# Altium project R1051-Caceres-PF.PrjPcb (part 2 of 3)

## Sheet Audio Memory.SchDoc: Audio Memory
size A4; Organization: Altium Limited; Address1: L3, 12a Rodborough Rd; Address2: Frenchs Forest; Address3: NSW; Address4: Australia 2086; Revision: 1; SheetNumber: 7; SheetTotal: 11; Alumno: Diego Caceres; Curso: R1051; Materia: Sistemas de Representación; Docentes: Ing. Perdomo, Ing. Fuoco, Ing. Giorno, Sr. Vergili
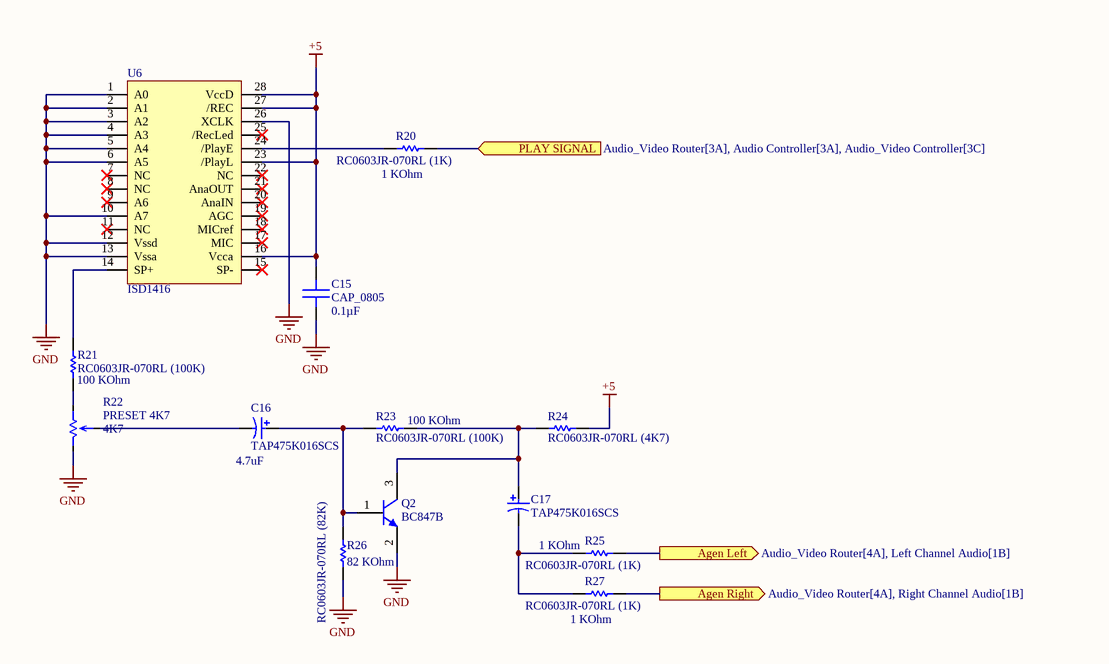
[diagram p6: Audio Memory.SchDoc]

### Parts
C15  CAP_0805  value 0.1µF  [0805_CAPACITOR_DCACERES]
C16  TAP475K016SCS  Capacitance: 4.7uF  [AVX-TAP475K016SCS]
C17  TAP475K016SCS  [AVX-TAP475K016SCS]
Q2  BC847B  [INF-SOT23_M]
R20  RC0603JR-070RL (1K)  Resistance: 1 KOhm  [RESC1608X55X25ML10T15]
R21  RC0603JR-070RL (100K)  Resistance: 100 KOhm  [RESC1608X55X25ML10T15]
R22  PRESET 4K7  value 4K7  [3386P_PRESET_4K7_DCaceres]
R23  RC0603JR-070RL (100K)  Resistance: 100 KOhm  [RESC1608X55X25ML10T15]
R24  RC0603JR-070RL (4K7)  [RESC1608X55X25ML10T15]
R25  RC0603JR-070RL (1K)  Resistance: 1 KOhm  [RESC1608X55X25ML10T15]
R26  RC0603JR-070RL (82K)  Resistance: 82 KOhm  [RESC1608X55X25ML10T15]
R27  RC0603JR-070RL (1K)  Resistance: 1 KOhm  [RESC1608X55X25ML10T15]
U6  ISD1416  [28-Lead_0.600-Inch_PDIP_ISD1416_DCACERES]

### Ports
Agen Left (out, see Audio_Video Router[4A], Left Channel Audio[1B]), Agen Right (out, see Audio_Video Router[4A], Right Channel Audio[1B]), PLAY SIGNAL (in, see Audio_Video Router[3A], Audio Controller[3A], Audio_Video Controller[3C])

### Nets
+5: C15.2 R24.2 U6.16(Vcca) U6.23(/PlayL) U6.27(/REC) U6.28(VccD)  [project net VDD]
GND: C15.1 Q2.2(E) R22.1 R26.2 U6.1(A0) U6.2(A1) U6.3(A2) U6.4(A3) U6.5(A4) U6.6(A5) U6.10(A7) U6.12(Vssd) U6.13(Vssa) U6.26(XCLK)
Agen Left: R25.1 ; port Agen Left
Agen Right: R27.1 ; port Agen Right
PLAY SIGNAL: R20.1 ; port PLAY SIGNAL
NetC16_1: C16.1 Q2.1(B) R23.1 R26.1
NetC16_2: C16.2 R22.3
NetC17_1: C17.1 Q2.3(C) R23.2 R24.1
NetC17_2: C17.2 R25.2 R27.2
NetR20_2: R20.2 U6.24(/PlayE)
NetR21_1: R21.1 U6.14(SP+)
NetR21_2: R21.2 R22.2

Not connected (* = marked no-connect by the designer): U6 7(NC)* 8(NC)* 9(A6)* 11(NC)* 15(SP-)* 17(MIC)* 18(MICref)* 19(AGC)* 20(AnaIN)* 21(AnaOUT)* 22(NC)* 25(/RecLed)*

### Notes on the sheet
- Title:
- Revision:
- Alumno:
- Materia:
- Docentes:
- Curso:
- File:
- Date:
- Sheet
- of

### Library data of the parts
C15 = CAPACITOR_0805_Caceres: Capacitor SMD, encapsulado 0805; SizePackage: 0805; ComponentLink1Description: Datasheet1; ComponentLink1URL: https://www.mouser.com/datasheet/2/40/AutoMLCCKAM-3216307.pdf; ComponentLink2Description: Datasheet2; ComponentLink2URL: https://www.mouser.com/datasheet/2/447/KEM_C1086_U2J-3316409.pdf; ComponentLink3Description: Datasheet3; ComponentLink3URL: https://product.tdk.com/system/files/dam/doc/product/capacitor/ceramic/mlcc/catalog/mlcc_commercial_soft_en.pdf
C16 = CMP-2000-07562-1: Dipped Radial Capacitor, 4.7 uF, +/- 10%, 16 V, -55 to 125 degC, RoHS, Bulk; Manufacturer: AVX; Life (Hours): 1000Hour; Dissipation Factor: 6%; Voltage: 16V; Polarity: Polar; ESR (Equivalent Series Resistance): 5Ohm; Lead Diameter: 0.5mm; Dielectric Material: Tantalum; Leakage Current: 600nA; Mounting Technology: ThroughHole; Tolerance: 10%; Number of Pins: 2; REACH SVHC: NoSVHC; RoHSCompliant: True; Min Operating Temperature: -55degC; Packaging: Bulk; Termination: Radial; Case\/Package: Dipped; Lead Free: LeadFree; Voltage Rating: 16V; Radiation Hardening: No; Package Quantity: 1000; Voltage Rating (DC): 16V; Height - Seated (Max): 0.295inch; Mount: PCB; Max Operating Temperature: 125degC; Datasheet URL: http://datasheets.avx.com/tap.pdf; Datasheet Version: 08/2015; Manufacturer URL: http://www.avx.com/; Package Reference: TAP475K016SCS; Lead Pitch: 2.5mm; Length: 7.5mm; Package Description: 2-Pin Through Hole Device, Dia 4.5 mm, Height 7.5 mm; Height: 7.5mm; Diameter: 4.5mm
C17 = CMP-2000-07562-1: Dipped Radial Capacitor, 4.7 uF, +/- 10%, 16 V, -55 to 125 degC, RoHS, Bulk; Manufacturer: AVX; Life (Hours): 1000Hour; Dissipation Factor: 6%; Voltage: 16V; Polarity: Polar; ESR (Equivalent Series Resistance): 5Ohm; Lead Diameter: 0.5mm; Dielectric Material: Tantalum; Capacitance: 4.7uF; Leakage Current: 600nA; Mounting Technology: ThroughHole; Tolerance: 10%; Number of Pins: 2; REACH SVHC: NoSVHC; RoHSCompliant: True; Min Operating Temperature: -55degC; Packaging: Bulk; Termination: Radial; Case\/Package: Dipped; Lead Free: LeadFree; Voltage Rating: 16V; Radiation Hardening: No; Package Quantity: 1000; Voltage Rating (DC): 16V; Height - Seated (Max): 0.295inch; Mount: PCB; Max Operating Temperature: 125degC; Datasheet URL: http://datasheets.avx.com/tap.pdf; Datasheet Version: 08/2015; Manufacturer URL: http://www.avx.com/; Package Reference: TAP475K016SCS; Lead Pitch: 2.5mm; Length: 7.5mm; Package Description: 2-Pin Through Hole Device, Dia 4.5 mm, Height 7.5 mm; Height: 7.5mm; Diameter: 4.5mm
Q2 = CMP-1177-00042-1: NPN Silicon AF Transistor, 45 V VCEO, 100 mA IC, SOT23, Reel, Green; Manufacturer: Infineon; VEBO (max): 6Â V; ICBO (max): 15Â nA; VCBO (max): 50Â V; IBM (max): 200Â mA; Green: TRUE; Ptot (max): 330Â mW; fT (typ): 250Â MHz; IC (max): 100Â mA; VCEO (max): 45Â V; PackageDescription: 3-Pin Small Outline Transistor Package, 1.3 x 2.9 mm Body, 0.95 mm Pitch; ComponentLink3URL: http://www.infineon.com/dgdl/SOT23-Package_Overview.pdf?folderId=db3a30431936bc4b0119532290053c66&fileId=db3a30431936bc4b0119533468123c85; PackageVersion: Apr-08; Packing: Reel; ComponentLink3Description: Package Specification; ComponentLink2URL: http://www.infineon.com/dgdl/bc847series_bc848series_bc849series_bc850series.pdf?folderId=db3a304314dca389011541d30fa21656&fileId=db3a304314dca389011541d4630a1657; ComponentLink1URL: http://www.infineon.com/; ComponentLink2Description: Datasheet; Polarity: NPN; Mounting Technology: Surface Mount; PackageReference: SOT23; ICM (max): 200Â mA; ComponentLink1Description: Manufacturer URL; PartNumber: BC847B
R20 R21 R23 R25-R27 = CMP-2100-03667-1: as R1 on sheet Sync Decoder; Width: 0.8mm; Max Operating Temperature: 155degC; Tolerance: 5%; Package Reference: 0603; Height: 0.45mm; Depth: 0.8mm; Package Description: 2-Pin Surface Mount Device, Body 1.6 x 0.8 mm; Termination: SMD/SMT; Package Quantity: 5000; Case/Package: 0603; Case Code (Imperial): 0603; Radiation Hardening: No; Number of Pins: 2; Length: 1.6mm; Lead Free: LeadFree; Voltage Rating (DC): 50V; Military Standard: Not; Datasheet URL: http://www.yageo.com/NewPortal/yageodocoutput?fileName=/pdf/R-Chip/PYu-RC_Group_51_RoHS_L_5.pdf; Manufacturer URL: http://www.yageo.com/; Packaging: TapeandReel; Case Code (Metric): 1608; Min Operating Temperature: -55degC; Composition: ThickFilm; RoHSCompliant: true; Contact Plating: Tin; Datasheet Version: Rev. 5, 10/2016; REACH SVHC: NoSVHC
R22 = Preset_4K7_Caceres: Preset 4K7, Thru HoleManufacturer Part Search 3386P-1-472LF; PartNumber: 3386P-1-472LF; ComponentLink1Description: Package Specification; ComponentLink1URL: https://ar.mouser.com/datasheet/2/54/3386-776606.pdf; ComponentLink2Description: URL Link; ComponentLink2URL: https://www.mouser.com/ProductDetail/Bourns/3386P-1-472LF?qs=g1MxsQ5vwlSvqan31esVSg%3D%3D
R24 = CMP-2100-03667-1: Chip Resistor, 0 Ohm, +/- 5%, 0.1 W, -55 to 155 degC, 0603 (1608 Metric), RoHS, Tape and Reel; Manufacturer: Yageo; Temperature Coefficient: 200ppm/degreesC; Voltage Rating: 50V; Power Rating: 100mW; Resistance: 0mOhm; Width: 0.8mm; Max Operating Temperature: 155degC; Tolerance: 5%; Package Reference: 0603; Height: 0.45mm; Depth: 0.8mm; Package Description: 2-Pin Surface Mount Device, Body 1.6 x 0.8 mm; Termination: SMD/SMT; Package Quantity: 5000; Case/Package: 0603; Case Code (Imperial): 0603; Radiation Hardening: No; Number of Pins: 2; Length: 1.6mm; Lead Free: LeadFree; Voltage Rating (DC): 50V; Military Standard: Not; Datasheet URL: http://www.yageo.com/NewPortal/yageodocoutput?fileName=/pdf/R-Chip/PYu-RC_Group_51_RoHS_L_5.pdf; Manufacturer URL: http://www.yageo.com/; Packaging: TapeandReel; Case Code (Metric): 1608; Min Operating Temperature: -55degC; Composition: ThickFilm; RoHSCompliant: true; Contact Plating: Tin; Datasheet Version: Rev. 5, 10/2016; REACH SVHC: NoSVHC
U6 = ISD1416_Caceres: ISD1416P, Thru Hole / IC MEM VOICE REC/PLAY 16S 28DIP / 28-Lead 0.600-Inch Plastic Dual Inline Package (PDIP); Manufacturer: Nuvoton; ComponentLink1Description: Datasheet1; ComponentLink1URL: https://pdf1.alldatasheet.com/datasheet-pdf/view/80293/ETC/ISD1416.html; PartNumber: ISD1416P; Package: PDIP-28; ComponentLink2Description: Datasheet2; ComponentLink2URL: https://datasheet.ciiva.com/1788/isd1400-rev1-3-1788428.pdf?src-supplier=Digi-Key

## Sheet RGB to PAL Encoder.SchDoc: RGB to PAL Encoder
size A4; Organization: Altium Limited; Address1: L3, 12a Rodborough Rd; Address2: Frenchs Forest; Address3: NSW; Address4: Australia 2086; Revision: 1; SheetNumber: 8; SheetTotal: 11; Alumno: Diego Caceres; Curso: R1051; Materia: Sistemas de Representación; Docentes: Ing. Perdomo, Ing. Fuoco, Ing. Giorno, Sr. Vergili
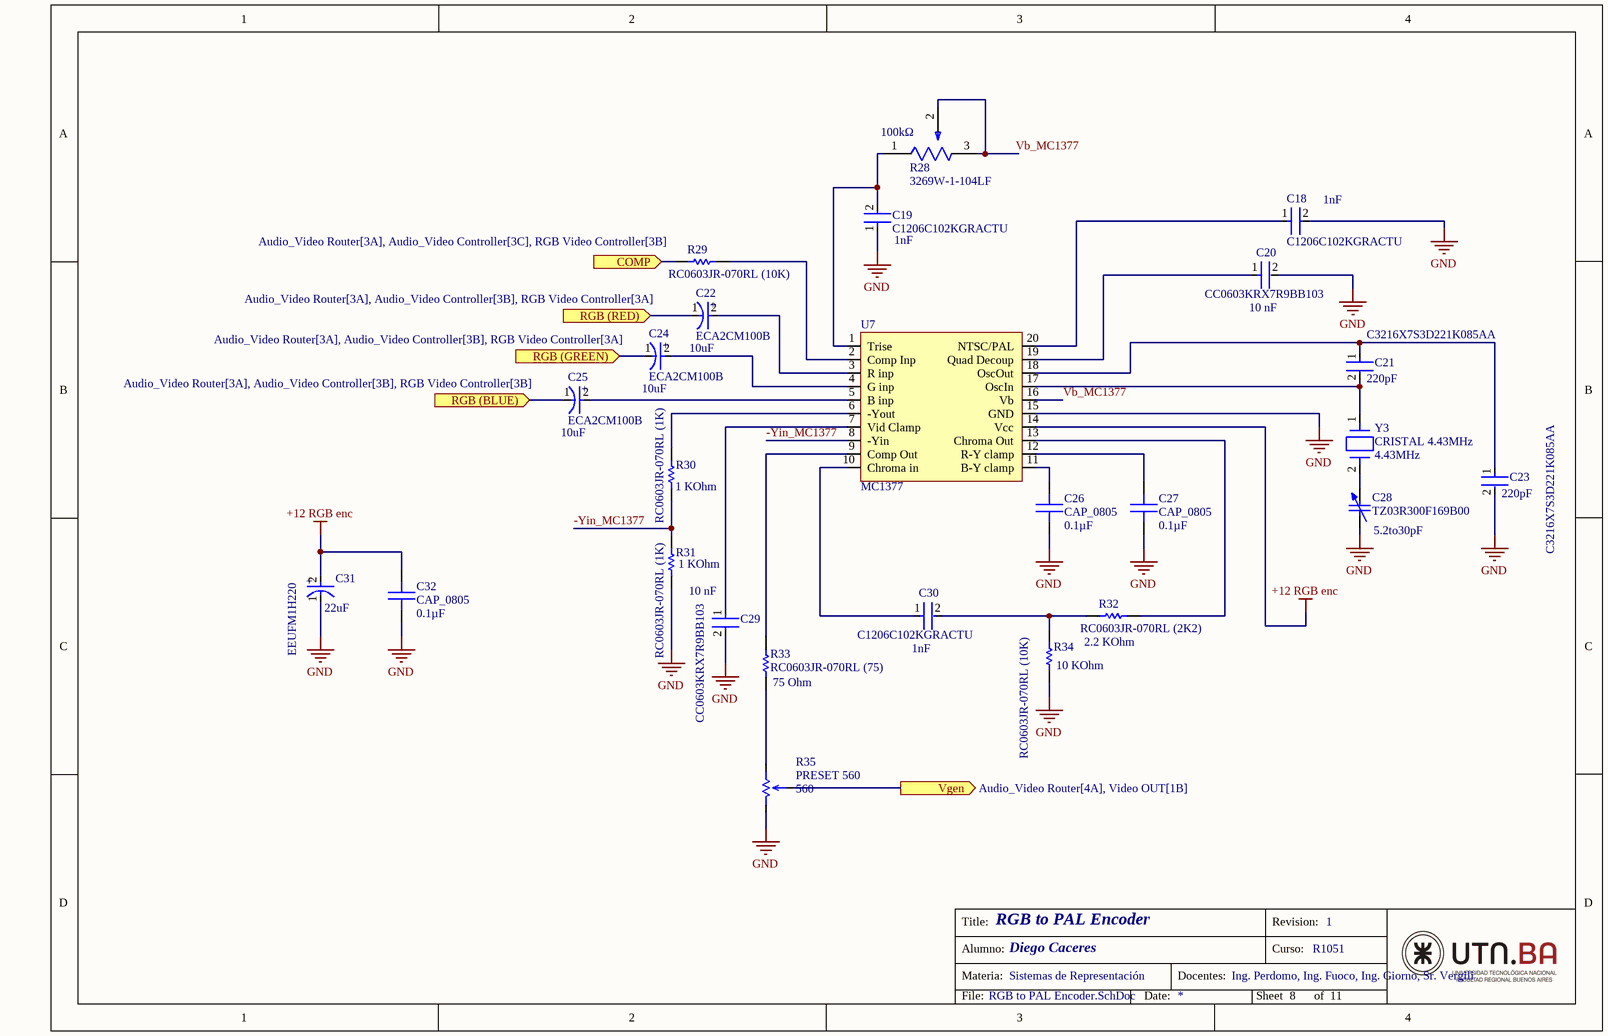
[diagram p7: RGB to PAL Encoder.SchDoc]

### Parts
C18  C1206C102KGRACTU  Capacitance: 1nF  [FP-C1206C-EF-MFG]
C19  C1206C102KGRACTU  Capacitance: 1nF  [FP-C1206C-EF-MFG]
C20  CC0603KRX7R9BB103  Capacitance: 10 nF  [FP-CC0603-DA-MFG]
C21  C3216X7S3D221K085AA  Capacitance: 220pF  [FP-C3216-085-0_2-MFG]
C22  ECA2CM100B  Capacitance: 10uF  [FP-RAD-TH-D_10_0_5-L_12_5-MFG]
C23  C3216X7S3D221K085AA  Capacitance: 220pF  [FP-C3216-085-0_2-MFG]
C24  ECA2CM100B  Capacitance: 10uF  [FP-RAD-TH-D_10_0_5-L_12_5-MFG]
C25  ECA2CM100B  Capacitance: 10uF  [FP-RAD-TH-D_10_0_5-L_12_5-MFG]
C26  CAP_0805  value 0.1µF  [0805_CAPACITOR_DCACERES]
C27  CAP_0805  value 0.1µF  [0805_CAPACITOR_DCACERES]
C28  TZ03R300F169B00  Capacitance: 5.2to30pF  [MURA-TZ03-2_V]
C29  CC0603KRX7R9BB103  value 10 nF  [FP-CC0603-DA-MFG]
C30  C1206C102KGRACTU  Capacitance: 1nF  [FP-C1206C-EF-MFG]
C31  EEUFM1H220  Capacitance: 22uF  [FP-RAD-TH-D_5_0_5-L_11_1-MFG]
C32  CAP_0805  value 0.1µF  [0805_CAPACITOR_DCACERES]
R28  3269W-1-104LF  Resistance: 100kΩ  [FP-3269W-MFG]
R29  RC0603JR-070RL (10K)  [RESC1608X55X25ML10T15]
R30  RC0603JR-070RL (1K)  Resistance: 1 KOhm  [RESC1608X55X25ML10T15]
R31  RC0603JR-070RL (1K)  Resistance: 1 KOhm  [RESC1608X55X25ML10T15]
R32  RC0603JR-070RL (2K2)  Resistance: 2.2 KOhm  [RESC1608X55X25ML10T15]
R33  RC0603JR-070RL (75)  Resistance: 75 Ohm  [RESC1608X55X25ML10T15]
R34  RC0603JR-070RL (10K)  Resistance: 10 KOhm  [RESC1608X55X25ML10T15]
R35  PRESET 560  value 560  [3386P_PRESET_560_DCaceres]
U7  MC1377  [CASE 738-03_ISSUE E_MC1377_DCACERES]
Y3  CRISTAL 4.43MHz  Frequency: 4.43MHz  [HC-49/US_SMD_CRISTAL 4.43MHz_DCACERES]

### Ports
COMP (in, see Audio_Video Router[3A], Audio_Video Controller[3C], RGB Video Controller[3B]), RGB (BLUE) (in, see Audio_Video Router[3A], Audio_Video Controller[3B], RGB Video Controller[3B]), RGB (GREEN) (in, see Audio_Video Router[3A], Audio_Video Controller[3B], RGB Video Controller[3A]), RGB (RED) (in, see Audio_Video Router[3A], Audio_Video Controller[3B], RGB Video Controller[3A]), Vgen (out, see Audio_Video Router[4A], Video OUT[1B])

### Nets
+12 RGB enc: C31.2(A) C32.2 U7.14(Vcc)
GND: C18.2 C19.1 C20.2 C23.2 C26.1 C27.1 C28.1 C29.2 C31.1(C) C32.1 R31.2 R34.2 R35.1 U7.15(GND)
-Yin_MC1377: R30.2 R31.1 U7.8(-Yin)
COMP: R29.2 ; port COMP
Vb_MC1377: R28.2(WIPER) R28.3(CW) U7.16(Vb)
Vgen: R35.3 ; port Vgen
NetC18_1: C18.1 U7.20(NTSC/PAL)
NetC19_2: C19.2 R28.1(CCW) U7.1(Trise)
NetC20_1: C20.1 U7.19(Quad_Decoup)
NetC21_1: C21.1 C23.1 U7.18(OscOut)
NetC21_2: C21.2 U7.17(OscIn) Y3.1
NetC22_1: C22.1(C) ; port RGB (RED)
NetC22_2: C22.2(A) U7.3(R_inp)
NetC24_1: C24.1(C) ; port RGB (GREEN)
NetC24_2: C24.2(A) U7.4(G_inp)
NetC25_1: C25.1(C) ; port RGB (BLUE)
NetC25_2: C25.2(A) U7.5(B_inp)
NetC26_2: C26.2 U7.11(B-Y_clamp)
NetC27_2: C27.2 U7.12(R-Y_clamp)
NetC28_2: C28.2 Y3.2
NetC29_1: C29.1 U7.7(Vid_Clamp)
NetC30_1: C30.1 U7.10(Chroma_in)
NetC30_2: C30.2 R32.2 R34.1
NetR29_1: R29.1 U7.2(Comp_Inp)
NetR30_1: R30.1 U7.6(-Yout)
NetR32_1: R32.1 U7.13(Chroma_Out)
NetR33_1: R33.1 R35.2
NetR33_2: R33.2 U7.9(Comp_Out)

### Notes on the sheet
- Title:
- Revision:
- Alumno:
- Materia:
- Docentes:
- Curso:
- File:
- Date:
- Sheet
- of
- (in symbol CMP-05427-000661-1) +
- (in symbol CMP-05427-001124-1) +

### Library data of the parts
C18 C19 C30 = CMP-03020-034681-1: CAP CER 1000PF 2KV X7R 1206; Tolerance: 10%; Dissipation Factor: 2.5%; Dielectric Material: Ceramic; Voltage Rating (DC): 2.5kV; Voltage: 2kV; REACH SVHC: No SVHC; Height: 1.6mm; Construction: Flat; Case/Package: 1206; Series: C; Mount: Surface Mount; RoHS Compliant: Yes; Package Quantity: 1; Length: 3.2mm; Width: 0.063inch; Voltage Rating: 2kV; Min Operating Temperature: -55°C; Case Code (Metric): 3216; Termination: SMD/SMT; Number of Pins: 2; Case Code (Imperial): 1206; Packaging: Tape and Reel; Dielectric: X7R; Thickness: 0.069inch; Depth: 1.6mm; Radiation Hardening: No; Max Operating Temperature: 125°C
C20 = CMP-2100-03600-2: CAP CER 10000PF 50V X7R 0603; Manufacturer: YAGEO; Tolerance: 0.1; Material: Ceramic; Temperature Coefficient: 15%; Value: 10 nF; Mouser Description: Multilayer Ceramic Capacitor, CC Series, 0.01 - F, - 10%, X7R, 50 V, 0603 [1608 Metric]; Digikey Description: CAP CER 10000PF 50V X7R 0603; Height: 0.9mm; Category: Cap; Temperature Characteristic: X7R; Footprint Url: http://www.yageo.com/exep/pages/download/literatures/UPY-C_GEN_24.pdf; Lead Free: Yes; Voltage Rating: 50 V; Manufacturer Part Number: CC0603KRX7R9BB103; Temperature: -55°C to +125°C; Device Class L3: Ceramic Capacitors; ComponentLink2Description: Datasheet; Voltage: 50 V; Package: CC0603-DA; Octopart: https://octopart.com/cc0603krx7r9bb103-yageo-192938; Automotive: No; Temperature Range High: +125°C; Temperature Range Low: -55°C; RoHS: TRUE; Device Class L1: Passive Components; ComponentLink2URL: http://www.yageo.com/documents/recent/UPY-GPHC_X7R_6.3V-to-50V_18.pdf; Device Class L2: Capacitors
C21 C23 = CMP-08246-003329-1: Multilayer Ceramic Capacitors 220pF ±10% 2000V X7S SMD 1206; Voltage Rating (DC): 2kV; Max Operating Temperature: 125°C; Termination: SMD/SMT; Dielectric: X7S; Case/Package: 1206; Mount: Surface Mount; Tolerance: 10%; Package Quantity: 1; Weight: 0.000571oz; Width: 0.063inch; RoHS Compliant: Yes; Thickness: 0.039inch; Series: C; Packaging: Tape and Reel; Min Operating Temperature: -55°C; Resistor Type: Ceramic; Case Code (Imperial): 1206; Voltage Rating: 2kV; Case Code (Metric): 3216; Depth: 1.6mm; Length: 0.126inch; REACH SVHC: No SVHC
C22 C24 C25 = CMP-05427-001124-1: Aluminum Electrolytic Capacitors (Radial Lead Type) 10uF ±20% 160V; Ripple Current: 105mA; Life (Hours): 2000Hour; Lead/Base Style: Straight; Weight: 0.01lb; Max Operating Temperature: 85°C; Termination: Radial; Min Operating Temperature: -25°C; Series: M; Tolerance: 20%; Voltage Rating (DC): 160V; RoHS Compliant: Yes; Case/Package: Radial; Radiation Hardening: No; Mount: Through Hole; Width: 4inch; Height: 12.5mm; Diameter: 10mm; Packaging: Ammo Pack; Lead Pitch: 5mm; Voltage Rating: 160V; Package Quantity: 500; Length: 12.5mm; Height - Seated (Max): 0.531inch
C26 C27 C32 = CAPACITOR_0805_Caceres: as C15 on sheet Audio Memory; ComponentLink1Description: Datasheet1; ComponentLink1URL: https://www.mouser.com/datasheet/2/40/AutoMLCCKAM-3216307.pdf; ComponentLink2Description: Datasheet2; ComponentLink2URL: https://www.mouser.com/datasheet/2/447/KEM_C1086_U2J-3316409.pdf; ComponentLink3Description: Datasheet3; ComponentLink3URL: https://product.tdk.com/system/files/dam/doc/product/capacitor/ceramic/mlcc/catalog/mlcc_commercial_soft_en.pdf
C28 = CMP-2000-07339-1: Variable Capacitor, Miniature Ceramic Trimmer, Green, 30 pF, -25 to 85 degC, 2-Pin THD, Bulk; Manufacturer: Murata; Dielectric: N750; Tolerance (%): 0to50%; Rated Voltage: 100V; Datasheet URL: https://datasheet.ciiva.com/29339/12-0130e-29339940.pdf; Mounting Technology: ThroughHole; Manufacturer URL: http://www.murata.com/; Package Reference: TZ03; Case Size/Dimension: 6x6x4.8mm; Datasheet Version: Rev. A, 04/2003; Package Description: 2-Pin Through Hole Device, Dia 6 mm, Body Length 4.8 mm
C29 = CMP-2100-03600-2: CAP CER 10000PF 50V X7R 0603; Manufacturer: YAGEO; Tolerance: 0.1; Material: Ceramic; Temperature Coefficient: 15%; Mouser Description: Multilayer Ceramic Capacitor, CC Series, 0.01 - F, - 10%, X7R, 50 V, 0603 [1608 Metric]; Digikey Description: CAP CER 10000PF 50V X7R 0603; Height: 0.9mm; Category: Cap; Temperature Characteristic: X7R; Footprint Url: http://www.yageo.com/exep/pages/download/literatures/UPY-C_GEN_24.pdf; Lead Free: Yes; Voltage Rating: 50 V; Manufacturer Part Number: CC0603KRX7R9BB103; Temperature: -55°C to +125°C; Device Class L3: Ceramic Capacitors; ComponentLink2Description: Datasheet; Voltage: 50 V; Package: CC0603-DA; Octopart: https://octopart.com/cc0603krx7r9bb103-yageo-192938; Automotive: No; Temperature Range High: +125°C; Temperature Range Low: -55°C; RoHS: TRUE; Device Class L1: Passive Components; ComponentLink2URL: http://www.yageo.com/documents/recent/UPY-GPHC_X7R_6.3V-to-50V_18.pdf; Device Class L2: Capacitors; Capacitance: 10 nF
C31 = CMP-05427-000661-1: Aluminum Electrolytic Capacitors (Radial Lead Type) 22uF ±20% 50V; Impedance: 340mR; Life (Hours): 2000Hour; Dissipation Factor: 0.1%; Ripple Current: 250mA; Lead Diameter: 0.5mm; REACH SVHC: No SVHC; Tolerance: 20%; Max Operating Temperature: 105°C; RoHS Compliant: Yes; Height - Seated (Max): 0.492inch; Number of Pins: 2; Case/Package: Radial; Series: FM; ESR (Equivalent Series Resistance): 340mR; Length: 11mm; Radiation Hardening: No; Voltage: 50V; Min Operating Temperature: -40°C; Voltage Rating: 50V; Voltage Rating (DC): 50V; Lead Free: Lead Free; Package Quantity: 200; Lead Pitch: 2mm; Height: 11mm; Mount: Through Hole; Construction: RADIAL; Termination: Radial; Diameter: 5mm; Packaging: Bulk
R28 = CMP-07234-000021-1: TRIMMER 100K OHM 0.25W SMD; Manufacturer: Bourns; Temperature Coefficient: 100ppm/°C; Tolerance: 10%; Value: 100kΩ; Composition: Cermet; Height: 8.96mm; ComponentLink2URL: https://www.bourns.com/docs/Product-Datasheets/3269.pdf; Mouser Description: Res Cermet Trimmer 100K Ohm 10% 1/4W 12(Elec)Turn 1.78mm (6.35 X 6.36 X 8.46mm) Gull Wing SMD Tube; ComponentLink2Description: Datasheet; Temperature Range High: +150°C; Temperature: -65°C to +150°C; Series: 3269; Device Class L1: Passive Components; RoHS: TRUE; Octopart: https://octopart.com/3269w-1-104lf-bourns-114162; Temperature Range Low: -65°C; Device Class L2: Resistors; Digikey Description: TRIMMER 100K OHM 0.25W SMD; Manufacturer Part Number: 3269W-1-104LF; Power Rating: 0.25W; Device Class L3: Variable Resistors and Potentiometers; Lead Free: Yes; Package: 3269W; Category: Res; Automotive: No
R29 = CMP-2100-03667-1: as R24 on sheet Audio Memory; Width: 0.8mm; Max Operating Temperature: 155degC; Tolerance: 5%; Package Reference: 0603; Height: 0.45mm; Depth: 0.8mm; Package Description: 2-Pin Surface Mount Device, Body 1.6 x 0.8 mm; Termination: SMD/SMT; Package Quantity: 5000; Case/Package: 0603; Case Code (Imperial): 0603; Radiation Hardening: No; Number of Pins: 2; Length: 1.6mm; Lead Free: LeadFree; Voltage Rating (DC): 50V; Military Standard: Not; Datasheet URL: http://www.yageo.com/NewPortal/yageodocoutput?fileName=/pdf/R-Chip/PYu-RC_Group_51_RoHS_L_5.pdf; Manufacturer URL: http://www.yageo.com/; Packaging: TapeandReel; Case Code (Metric): 1608; Min Operating Temperature: -55degC; Composition: ThickFilm; RoHSCompliant: true; Contact Plating: Tin; Datasheet Version: Rev. 5, 10/2016; REACH SVHC: NoSVHC
R30-R34 = CMP-2100-03667-1: as R1 on sheet Sync Decoder; Width: 0.8mm; Max Operating Temperature: 155degC; Tolerance: 5%; Package Reference: 0603; Height: 0.45mm; Depth: 0.8mm; Package Description: 2-Pin Surface Mount Device, Body 1.6 x 0.8 mm; Termination: SMD/SMT; Package Quantity: 5000; Case/Package: 0603; Case Code (Imperial): 0603; Radiation Hardening: No; Number of Pins: 2; Length: 1.6mm; Lead Free: LeadFree; Voltage Rating (DC): 50V; Military Standard: Not; Datasheet URL: http://www.yageo.com/NewPortal/yageodocoutput?fileName=/pdf/R-Chip/PYu-RC_Group_51_RoHS_L_5.pdf; Manufacturer URL: http://www.yageo.com/; Packaging: TapeandReel; Case Code (Metric): 1608; Min Operating Temperature: -55degC; Composition: ThickFilm; RoHSCompliant: true; Contact Plating: Tin; Datasheet Version: Rev. 5, 10/2016; REACH SVHC: NoSVHC
R35 = Preset_560_Caceres: Preset 560, Thru Hole / Manufacturer Part Search 3386P-1-472LF; PartNumber: 3386P-1-472LF; ComponentLink1Description: Package Specification; ComponentLink1URL: https://ar.mouser.com/datasheet/2/54/3386-776606.pdf; ComponentLink2Description: URL Link; ComponentLink2URL: https://www.mouser.com/ProductDetail/Bourns/3386P-1-472LF?qs=g1MxsQ5vwlSvqan31esVSg%3D%3D
U7 = MC1377_Caceres: MC1377, Thru Hole; PartNumber: MC1377P; Manufacturer: Motorola; ComponentLink1Description: Datasheet; ComponentLink1URL: https://datasheet.ciiva.com/pdfs/VipMasterIC/IC/MOTO/MOTOS06243/MOTOS06243-1.pdf?src-supplier=IHS+Markit; PackageReference: DIP20 CASE 738; Terminal Form: Through Hole
Y3 = Cristal_4.43MHz_Caceres: Cristal SMD 4.43MHz; PartNumber: ABLS-4.433619MHZ-B4-T; Manufacturer: Abracon; ComponentLink1Description: Datasheet; ComponentLink1URL: https://www.mouser.com/datasheet/2/3/abls-1664338.pdf; ComponentLink2Description: URL Link1; ComponentLink2URL: https://www.mouser.com/ProductDetail/ABRACON/ABLS-4.433619MHZ-B4-T?qs=yTU0IcKoRlG9N56A3ODkIg%3D%3D; ComponentLink3Description: URL Link2; ComponentLink3URL: https://www.digikey.com/en/products/detail/abracon-llc/ABLS-4-433619MHZ-B4-T/2184147?s=N4IgTCBcDaIIICEAyBlAtAFgHQYMy4DYBGATgFkAJALTQQzQBUQBdAXyA; Package: HC-49/US; TerminalForm: SMD; Series: ABLS

## Sheet Video OUT.SchDoc: Video OUT
size A4; Organization: Altium Limited; Address1: L3, 12a Rodborough Rd; Address2: Frenchs Forest; Address3: NSW; Address4: Australia 2086; Revision: 1; SheetNumber: 9; SheetTotal: 11; Alumno: Diego Caceres; Curso: R1051; Materia: Sistemas de Representación; Docentes: Ing. Perdomo, Ing. Fuoco, Ing. Giorno, Sr. Vergili
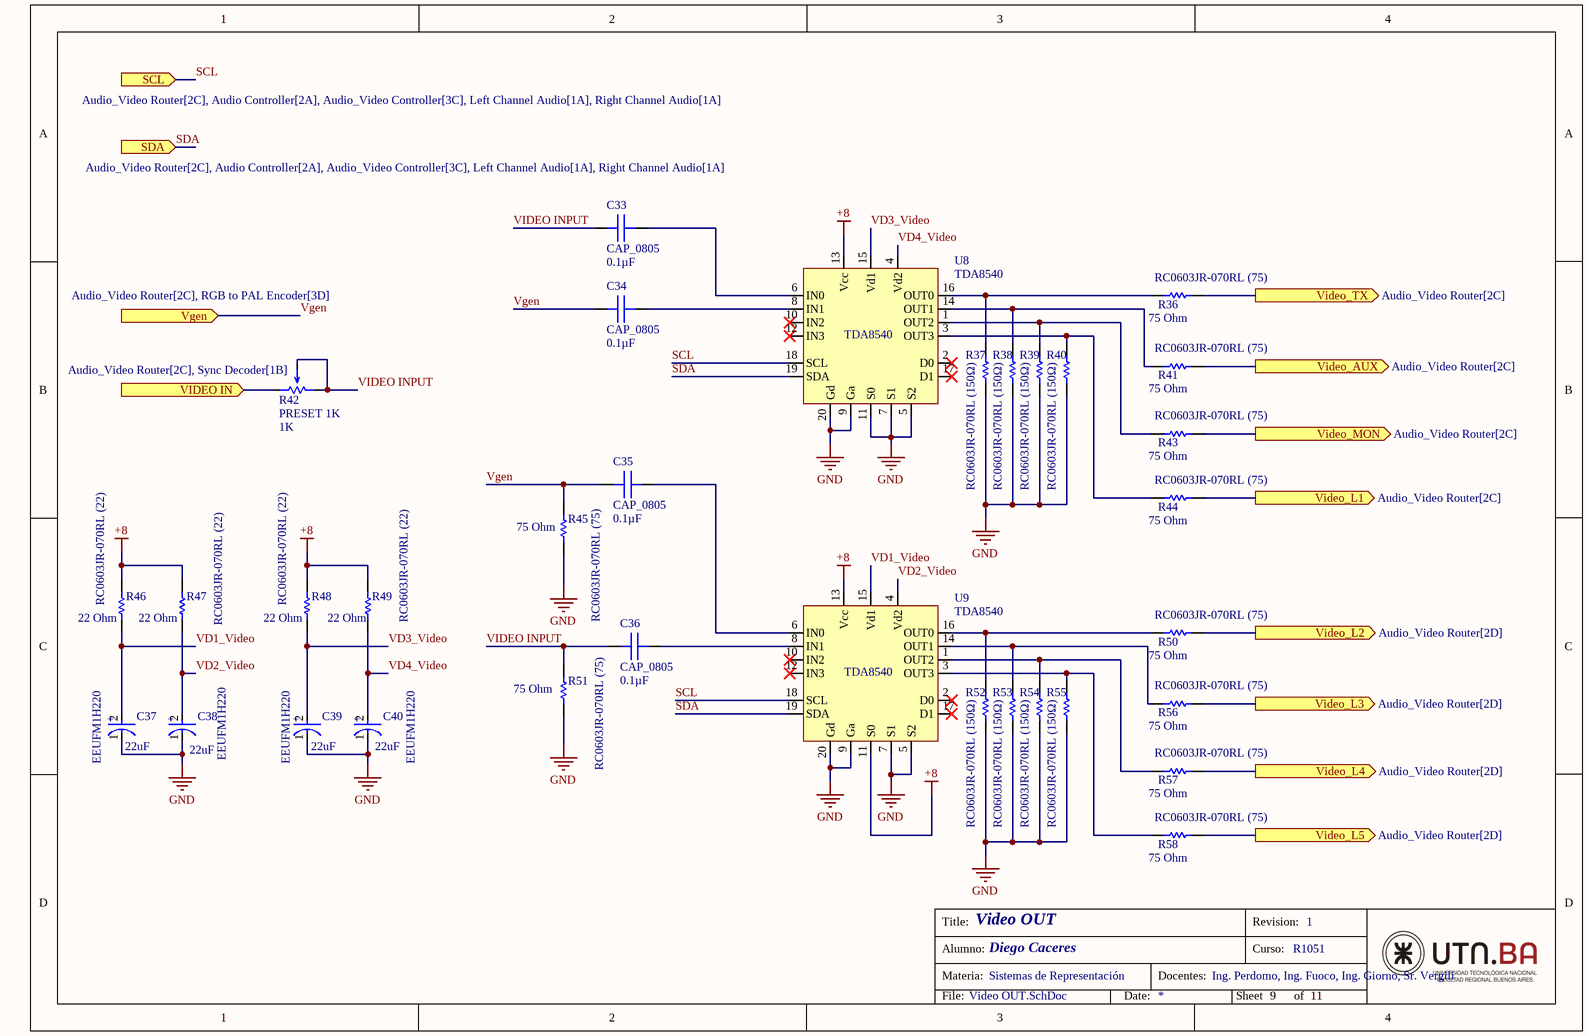
[diagram p8: Video OUT.SchDoc]

### Parts
C33  CAP_0805  value 0.1µF  [0805_CAPACITOR_DCACERES]
C34  CAP_0805  value 0.1µF  [0805_CAPACITOR_DCACERES]
C35  CAP_0805  value 0.1µF  [0805_CAPACITOR_DCACERES]
C36  CAP_0805  value 0.1µF  [0805_CAPACITOR_DCACERES]
C37  EEUFM1H220  Capacitance: 22uF  [FP-RAD-TH-D_5_0_5-L_11_1-MFG]
C38  EEUFM1H220  Capacitance: 22uF  [FP-RAD-TH-D_5_0_5-L_11_1-MFG]
C39  EEUFM1H220  Capacitance: 22uF  [FP-RAD-TH-D_5_0_5-L_11_1-MFG]
C40  EEUFM1H220  Capacitance: 22uF  [FP-RAD-TH-D_5_0_5-L_11_1-MFG]
R36  RC0603JR-070RL (75)  Resistance: 75 Ohm  [RESC1608X55X25ML10T15]
R37  RC0603JR-070RL (150Ω)  [RESC1608X55X25ML10T15]
R38  RC0603JR-070RL (150Ω)  [RESC1608X55X25ML10T15]
R39  RC0603JR-070RL (150Ω)  [RESC1608X55X25ML10T15]
R40  RC0603JR-070RL (150Ω)  [RESC1608X55X25ML10T15]
R41  RC0603JR-070RL (75)  Resistance: 75 Ohm  [RESC1608X55X25ML10T15]
R42  PRESET 1K  value 1K  [3386P_PRESET_1K_DCaceres]
R43  RC0603JR-070RL (75)  Resistance: 75 Ohm  [RESC1608X55X25ML10T15]
R44  RC0603JR-070RL (75)  Resistance: 75 Ohm  [RESC1608X55X25ML10T15]
R45  RC0603JR-070RL (75)  Resistance: 75 Ohm  [RESC1608X55X25ML10T15]
R46  RC0603JR-070RL (22)  Resistance: 22 Ohm  [RESC1608X55X25ML10T15]
R47  RC0603JR-070RL (22)  Resistance: 22 Ohm  [RESC1608X55X25ML10T15]
R48  RC0603JR-070RL (22)  Resistance: 22 Ohm  [RESC1608X55X25ML10T15]
R49  RC0603JR-070RL (22)  Resistance: 22 Ohm  [RESC1608X55X25ML10T15]
R50  RC0603JR-070RL (75)  Resistance: 75 Ohm  [RESC1608X55X25ML10T15]
R51  RC0603JR-070RL (75)  Resistance: 75 Ohm  [RESC1608X55X25ML10T15]
R52  RC0603JR-070RL (150Ω)  [RESC1608X55X25ML10T15]
R53  RC0603JR-070RL (150Ω)  [RESC1608X55X25ML10T15]
R54  RC0603JR-070RL (150Ω)  [RESC1608X55X25ML10T15]
R55  RC0603JR-070RL (150Ω)  [RESC1608X55X25ML10T15]
R56  RC0603JR-070RL (75)  Resistance: 75 Ohm  [RESC1608X55X25ML10T15]
R57  RC0603JR-070RL (75)  Resistance: 75 Ohm  [RESC1608X55X25ML10T15]
R58  RC0603JR-070RL (75)  Resistance: 75 Ohm  [RESC1608X55X25ML10T15]
U8  TDA8540  [SOT146-1_DIP20_TDA8540_DCACERES]
U9  TDA8540  [SOT146-1_DIP20_TDA8540_DCACERES]

### Ports
SCL (in, see Audio_Video Router[2C], Audio Controller[2A], Audio_Video Controller[3C], Left Channel Audio[1A], Right Channel Audio[1A]), SDA (in, see Audio_Video Router[2C], Audio Controller[2A], Audio_Video Controller[3C], Left Channel Audio[1A], Right Channel Audio[1A]), Vgen (in, see Audio_Video Router[2C], RGB to PAL Encoder[3D]), VIDEO IN (in, see Audio_Video Router[2C], Sync Decoder[1B]), Video_AUX (out, see Audio_Video Router[2C]), Video_L1 (out, see Audio_Video Router[2C]), Video_L2 (out, see Audio_Video Router[2D]), Video_L3 (out, see Audio_Video Router[2D]), Video_L4 (out, see Audio_Video Router[2D]), Video_L5 (out, see Audio_Video Router[2D]), Video_MON (out, see Audio_Video Router[2C]), Video_TX (out, see Audio_Video Router[2C])

### Nets
+8: R46.2 R47.2 R48.2 R49.2 U8.13(Vcc) U9.11(S0) U9.13(Vcc)
GND: C37.1(C) C38.1(C) C39.1(C) C40.1(C) R37.2 R38.2 R39.2 R40.2 R45.1 R51.1 R52.2 R53.2 R54.2 R55.2 U8.5(S2) U8.7(S1) U8.9(Ga) U8.11(S0) U8.20(Gd) U9.5(S2) U9.7(S1) U9.9(Ga) U9.20(Gd)
SCL: U8.18(SCL) U9.18(SCL) ; port SCL
SDA: U8.19(SDA) U9.19(SDA) ; port SDA
VD1_Video: C37.2(A) R46.1 U9.15(Vd1)
VD2_Video: C38.2(A) R47.1 U9.4(Vd2)
VD3_Video: C39.2(A) R48.1 U8.15(Vd1)
VD4_Video: C40.2(A) R49.1 U8.4(Vd2)
Vgen: C34.1 C35.1 R45.2 ; port Vgen
VIDEO IN: R42.2 ; port VIDEO IN
VIDEO INPUT: C33.1 C36.1 R42.1 R42.3 R51.2
NetC33_2: C33.2 U8.6(IN0)
NetC34_2: C34.2 U8.8(IN1)
NetC35_2: C35.2 U9.6(IN0)
NetC36_2: C36.2 U9.8(IN1)
NetJ5_1: R36.2 ; port Video_TX
NetJ5_2: R41.2 ; port Video_AUX
NetJ5_3: R43.2 ; port Video_MON
NetJ5_4: R44.2 ; port Video_L1
NetJ5_5: R50.2 ; port Video_L2
NetJ5_6: R56.2 ; port Video_L3
NetJ5_7: R57.2 ; port Video_L4
NetJ5_8: R58.2 ; port Video_L5
NetR36_1: R36.1 R37.1 U8.16(OUT0)
NetR38_1: R38.1 R41.1 U8.14(OUT1)
NetR39_1: R39.1 R43.1 U8.1(OUT2)
NetR40_1: R40.1 R44.1 U8.3(OUT3)
NetR50_1: R50.1 R52.1 U9.16(OUT0)
NetR53_1: R53.1 R56.1 U9.14(OUT1)
NetR54_1: R54.1 R57.1 U9.1(OUT2)
NetR55_1: R55.1 R58.1 U9.3(OUT3)

Not connected (* = marked no-connect by the designer): U8 2(D0)* 10(IN2)* 12(IN3)* 17(D1)*; U9 2(D0)* 10(IN2)* 12(IN3)* 17(D1)*

### Notes on the sheet
- Title:
- Revision:
- Alumno:
- Materia:
- Docentes:
- Curso:
- File:
- Date:
- Sheet
- of
- (in symbol CMP-05427-000661-1) +

### Library data of the parts
C33-C36 = CAPACITOR_0805_Caceres: as C15 on sheet Audio Memory; ComponentLink1Description: Datasheet1; ComponentLink1URL: https://www.mouser.com/datasheet/2/40/AutoMLCCKAM-3216307.pdf; ComponentLink2Description: Datasheet2; ComponentLink2URL: https://www.mouser.com/datasheet/2/447/KEM_C1086_U2J-3316409.pdf; ComponentLink3Description: Datasheet3; ComponentLink3URL: https://product.tdk.com/system/files/dam/doc/product/capacitor/ceramic/mlcc/catalog/mlcc_commercial_soft_en.pdf
C37-C40 = CMP-05427-000661-1: as C31 on sheet RGB to PAL Encoder; REACH SVHC: No SVHC; Tolerance: 20%; Max Operating Temperature: 105°C; RoHS Compliant: Yes; Height - Seated (Max): 0.492inch; Number of Pins: 2; Case/Package: Radial; Series: FM; ESR (Equivalent Series Resistance): 340mR; Length: 11mm; Radiation Hardening: No; Voltage: 50V; Min Operating Temperature: -40°C; Voltage Rating: 50V; Voltage Rating (DC): 50V; Lead Free: Lead Free; Package Quantity: 200; Lead Pitch: 2mm; Height: 11mm; Mount: Through Hole; Construction: RADIAL; Termination: Radial; Diameter: 5mm; Packaging: Bulk
R36 R41 R43-R51 R56-R58 = CMP-2100-03667-1: as R1 on sheet Sync Decoder; Width: 0.8mm; Max Operating Temperature: 155degC; Tolerance: 5%; Package Reference: 0603; Height: 0.45mm; Depth: 0.8mm; Package Description: 2-Pin Surface Mount Device, Body 1.6 x 0.8 mm; Termination: SMD/SMT; Package Quantity: 5000; Case/Package: 0603; Case Code (Imperial): 0603; Radiation Hardening: No; Number of Pins: 2; Length: 1.6mm; Lead Free: LeadFree; Voltage Rating (DC): 50V; Military Standard: Not; Datasheet URL: http://www.yageo.com/NewPortal/yageodocoutput?fileName=/pdf/R-Chip/PYu-RC_Group_51_RoHS_L_5.pdf; Manufacturer URL: http://www.yageo.com/; Packaging: TapeandReel; Case Code (Metric): 1608; Min Operating Temperature: -55degC; Composition: ThickFilm; RoHSCompliant: true; Contact Plating: Tin; Datasheet Version: Rev. 5, 10/2016; REACH SVHC: NoSVHC
R37-R40 R52-R55 = CMP-2100-03667-1: Chip Resistor, 0 Ohm, +/- 5%, 0.1 W, -55 to 155 degC, 0603 (1608 Metric), RoHS, Tape and Reel; Manufacturer: Yageo; Temperature Coefficient: 200ppm/degreesC; Voltage Rating: 50V; Power Rating: 100mW; Resistance: 150 Ohm; Width: 0.8mm; Max Operating Temperature: 155degC; Tolerance: 5%; Package Reference: 0603; Height: 0.45mm; Depth: 0.8mm; Package Description: 2-Pin Surface Mount Device, Body 1.6 x 0.8 mm; Termination: SMD/SMT; Package Quantity: 5000; Case/Package: 0603; Case Code (Imperial): 0603; Radiation Hardening: No; Number of Pins: 2; Length: 1.6mm; Lead Free: LeadFree; Voltage Rating (DC): 50V; Military Standard: Not; Datasheet URL: http://www.yageo.com/NewPortal/yageodocoutput?fileName=/pdf/R-Chip/PYu-RC_Group_51_RoHS_L_5.pdf; Manufacturer URL: http://www.yageo.com/; Packaging: TapeandReel; Case Code (Metric): 1608; Min Operating Temperature: -55degC; Composition: ThickFilm; RoHSCompliant: true; Contact Plating: Tin; Datasheet Version: Rev. 5, 10/2016; REACH SVHC: NoSVHC
R42 = Preset_1K_Caceres: Preset 1k, Thru Hole / Manufacturer Part Search 3386P-1-472LF; PartNumber: 3386P-1-472LF; ComponentLink1Description: Package Specification; ComponentLink1URL: https://ar.mouser.com/datasheet/2/54/3386-776606.pdf; ComponentLink2Description: URL Link; ComponentLink2URL: https://www.mouser.com/ProductDetail/Bourns/3386P-1-472LF?qs=g1MxsQ5vwlSvqan31esVSg%3D%3D
U8 U9 = TDA8540_Caceres: TDA8540, Thtu Hole / Plastic dual in-line package; 20 leads (300 mil); DIP20; SOT146-1.; ComponentLink1Description: Datasheet; ComponentLink1URL: https://pdf1.alldatasheet.es/datasheet-pdf/view/19499/PHILIPS/TDA8540.html; ComponentLink2Description: URL Link; ComponentLink2URL: https://www.nxp.com/products/no-longer-manufactured/tda8540t:TDA8540T; ComponentLink3Description: Discontinuation Notice; ComponentLink3URL: https://www.nxp.com/wcm_documents/products/eol/dn46exha.pdf; ComponentLink4Description: Package Specification; ComponentLink4URL: https://html.alldatasheet.es/html-pdf/19499/PHILIPS/TDA8540/3258/13/TDA8540.html; PartNumber: TDA8540; PackageReference: DIP20; Status: Discontinued

## Sheet Left Channel Audio.SchDoc: Left Channel Audio
size A4; Organization: Altium Limited; Address1: L3, 12a Rodborough Rd; Address2: Frenchs Forest; Address3: NSW; Address4: Australia 2086; Revision: 1; SheetNumber: 10; SheetTotal: 11; Alumno: Diego Caceres; Curso: R1051; Materia: Sistemas de Representación; Docentes: Ing. Perdomo, Ing. Fuoco, Ing. Giorno, Sr. Vergili
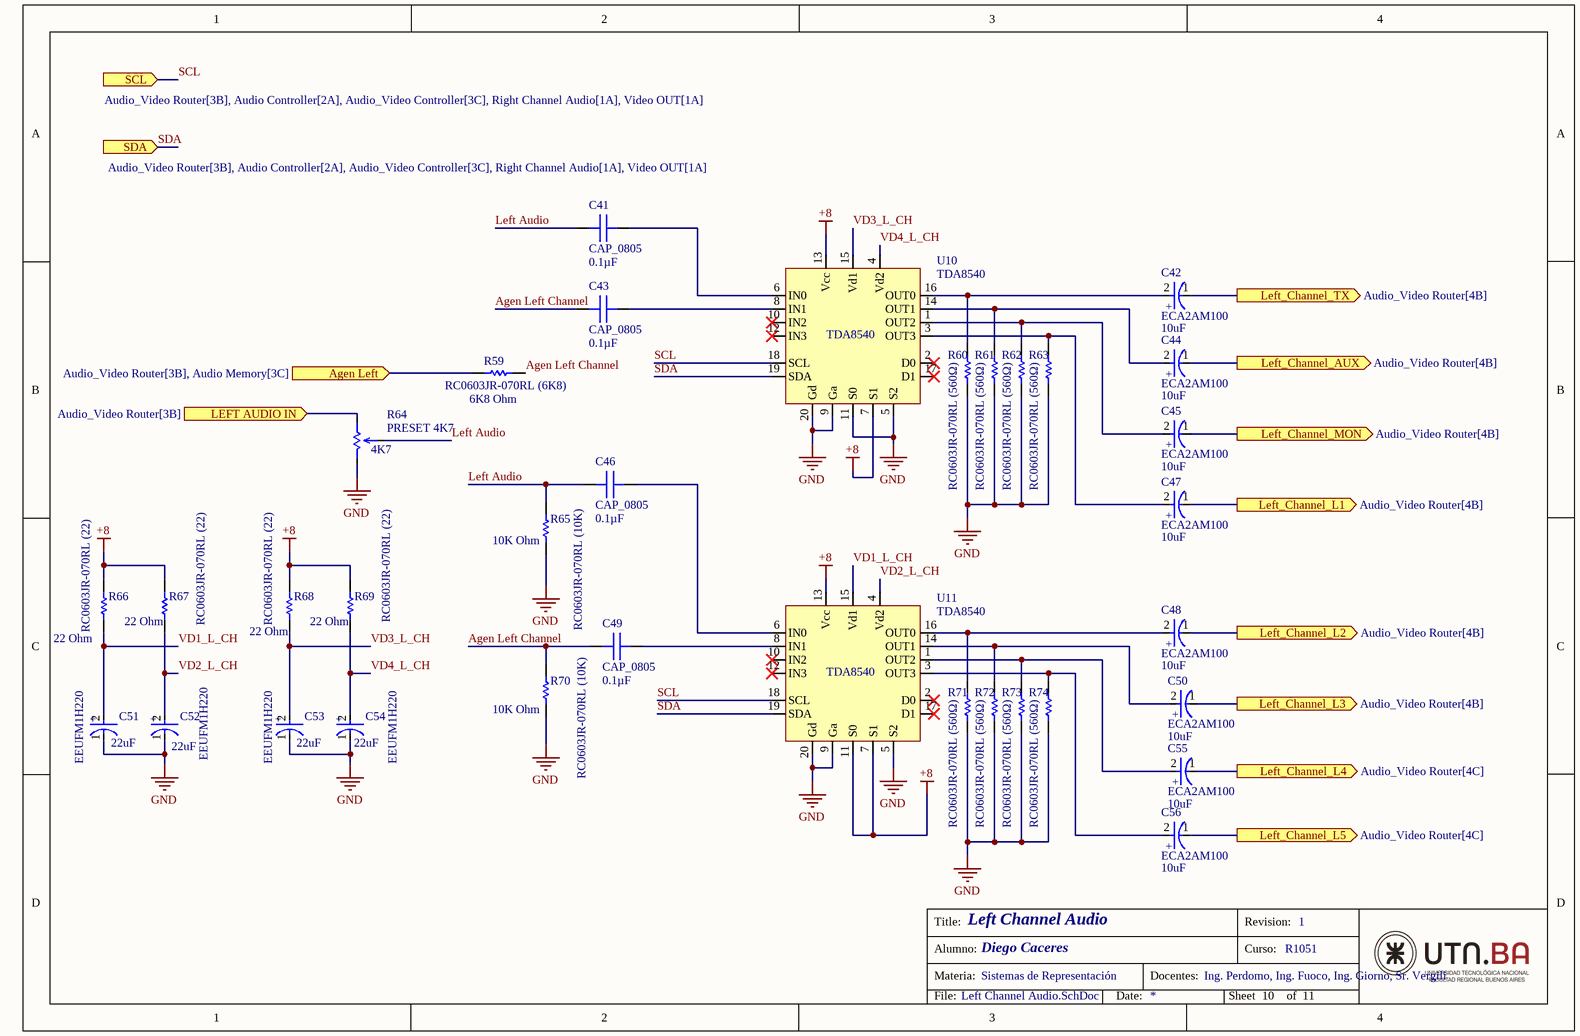
[diagram p9: Left Channel Audio.SchDoc]

### Parts
C41  CAP_0805  value 0.1µF  [0805_CAPACITOR_DCACERES]
C42  ECA2AM100  Capacitance: 10uF  [FP-RAD-TH-D_5_0_5-L_11_1-MFG]
C43  CAP_0805  value 0.1µF  [0805_CAPACITOR_DCACERES]
C44  ECA2AM100  Capacitance: 10uF  [FP-RAD-TH-D_5_0_5-L_11_1-MFG]
C45  ECA2AM100  Capacitance: 10uF  [FP-RAD-TH-D_5_0_5-L_11_1-MFG]
C46  CAP_0805  value 0.1µF  [0805_CAPACITOR_DCACERES]
C47  ECA2AM100  Capacitance: 10uF  [FP-RAD-TH-D_5_0_5-L_11_1-MFG]
C48  ECA2AM100  Capacitance: 10uF  [FP-RAD-TH-D_5_0_5-L_11_1-MFG]
C49  CAP_0805  value 0.1µF  [0805_CAPACITOR_DCACERES]
C50  ECA2AM100  Capacitance: 10uF  [FP-RAD-TH-D_5_0_5-L_11_1-MFG]
C51  EEUFM1H220  Capacitance: 22uF  [FP-RAD-TH-D_5_0_5-L_11_1-MFG]
C52  EEUFM1H220  Capacitance: 22uF  [FP-RAD-TH-D_5_0_5-L_11_1-MFG]
C53  EEUFM1H220  Capacitance: 22uF  [FP-RAD-TH-D_5_0_5-L_11_1-MFG]
C54  EEUFM1H220  Capacitance: 22uF  [FP-RAD-TH-D_5_0_5-L_11_1-MFG]
C55  ECA2AM100  Capacitance: 10uF  [FP-RAD-TH-D_5_0_5-L_11_1-MFG]
C56  ECA2AM100  Capacitance: 10uF  [FP-RAD-TH-D_5_0_5-L_11_1-MFG]
R59  RC0603JR-070RL (6K8)  Resistance: 6K8 Ohm  [RESC1608X55X25ML10T15]
R60  RC0603JR-070RL (560Ω)  [RESC1608X55X25ML10T15]
R61  RC0603JR-070RL (560Ω)  [RESC1608X55X25ML10T15]
R62  RC0603JR-070RL (560Ω)  [RESC1608X55X25ML10T15]
R63  RC0603JR-070RL (560Ω)  [RESC1608X55X25ML10T15]
R64  PRESET 4K7  value 4K7  [3386P_PRESET_4K7_DCaceres]
R65  RC0603JR-070RL (10K)  Resistance: 10K Ohm  [RESC1608X55X25ML10T15]
R66  RC0603JR-070RL (22)  Resistance: 22 Ohm  [RESC1608X55X25ML10T15]
R67  RC0603JR-070RL (22)  Resistance: 22 Ohm  [RESC1608X55X25ML10T15]
R68  RC0603JR-070RL (22)  Resistance: 22 Ohm  [RESC1608X55X25ML10T15]
R69  RC0603JR-070RL (22)  Resistance: 22 Ohm  [RESC1608X55X25ML10T15]
R70  RC0603JR-070RL (10K)  Resistance: 10K Ohm  [RESC1608X55X25ML10T15]
R71  RC0603JR-070RL (560Ω)  [RESC1608X55X25ML10T15]
R72  RC0603JR-070RL (560Ω)  [RESC1608X55X25ML10T15]
R73  RC0603JR-070RL (560Ω)  [RESC1608X55X25ML10T15]
R74  RC0603JR-070RL (560Ω)  [RESC1608X55X25ML10T15]
U10  TDA8540  [SOT146-1_DIP20_TDA8540_DCACERES]
U11  TDA8540  [SOT146-1_DIP20_TDA8540_DCACERES]

### Ports
Agen Left (in, see Audio_Video Router[3B], Audio Memory[3C]), LEFT AUDIO IN (in, see Audio_Video Router[3B]), Left_Channel_AUX (out, see Audio_Video Router[4B]), Left_Channel_L1 (out, see Audio_Video Router[4B]), Left_Channel_L2 (out, see Audio_Video Router[4B]), Left_Channel_L3 (out, see Audio_Video Router[4B]), Left_Channel_L4 (out, see Audio_Video Router[4C]), Left_Channel_L5 (out, see Audio_Video Router[4C]), Left_Channel_MON (out, see Audio_Video Router[4B]), Left_Channel_TX (out, see Audio_Video Router[4B]), SCL (in, see Audio_Video Router[3B], Audio Controller[2A], Audio_Video Controller[3C], Right Channel Audio[1A], Video OUT[1A]), SDA (in, see Audio_Video Router[3B], Audio Controller[2A], Audio_Video Controller[3C], Right Channel Audio[1A], Video OUT[1A])

### Nets
+8: R66.2 R67.2 R68.2 R69.2 U10.7(S1) U10.13(Vcc) U11.7(S1) U11.11(S0) U11.13(Vcc)
GND: C51.1(C) C52.1(C) C53.1(C) C54.1(C) R60.2 R61.2 R62.2 R63.2 R64.1 R65.1 R70.1 R71.2 R72.2 R73.2 R74.2 U10.5(S2) U10.9(Ga) U10.11(S0) U10.20(Gd) U11.5(S2) U11.9(Ga) U11.20(Gd)
Agen Left: R59.1 ; port Agen Left
Agen Left Channel: C43.1 C49.1 R59.2 R70.2
Left Audio: C41.1 C46.1 R64.3 R65.2
LEFT AUDIO IN: R64.2 ; port LEFT AUDIO IN
SCL: U10.18(SCL) U11.18(SCL) ; port SCL
SDA: U10.19(SDA) U11.19(SDA) ; port SDA
VD1_L_CH: C51.2(A) R66.1 U11.15(Vd1)
VD2_L_CH: C52.2(A) R67.1 U11.4(Vd2)
VD3_L_CH: C53.2(A) R68.1 U10.15(Vd1)
VD4_L_CH: C54.2(A) R69.1 U10.4(Vd2)
NetC41_2: C41.2 U10.6(IN0)
NetC42_1: C42.1(C) ; port Left_Channel_TX
NetC42_2: C42.2(A) R60.1 U10.16(OUT0)
NetC43_2: C43.2 U10.8(IN1)
NetC44_1: C44.1(C) ; port Left_Channel_AUX
NetC44_2: C44.2(A) R61.1 U10.14(OUT1)
NetC45_1: C45.1(C) ; port Left_Channel_MON
NetC45_2: C45.2(A) R62.1 U10.1(OUT2)
NetC46_2: C46.2 U11.6(IN0)
NetC47_1: C47.1(C) ; port Left_Channel_L1
NetC47_2: C47.2(A) R63.1 U10.3(OUT3)
NetC48_1: C48.1(C) ; port Left_Channel_L2
NetC48_2: C48.2(A) R71.1 U11.16(OUT0)
NetC49_2: C49.2 U11.8(IN1)
NetC50_1: C50.1(C) ; port Left_Channel_L3
NetC50_2: C50.2(A) R72.1 U11.14(OUT1)
NetC55_1: C55.1(C) ; port Left_Channel_L4
NetC55_2: C55.2(A) R73.1 U11.1(OUT2)
NetC56_1: C56.1(C) ; port Left_Channel_L5
NetC56_2: C56.2(A) R74.1 U11.3(OUT3)

Not connected (* = marked no-connect by the designer): U10 2(D0)* 10(IN2)* 12(IN3)* 17(D1)*; U11 2(D0)* 10(IN2)* 12(IN3)* 17(D1)*

### Notes on the sheet
- Title:
- Revision:
- Alumno:
- Materia:
- Docentes:
- Curso:
- File:
- Date:
- Sheet
- of
- (in symbol CMP-05427-000661-1) +
- (in symbol CMP-05427-000869-1) +

### Library data of the parts
C41 C43 C46 C49 = CAPACITOR_0805_Caceres: as C15 on sheet Audio Memory; ComponentLink1Description: Datasheet1; ComponentLink1URL: https://www.mouser.com/datasheet/2/40/AutoMLCCKAM-3216307.pdf; ComponentLink2Description: Datasheet2; ComponentLink2URL: https://www.mouser.com/datasheet/2/447/KEM_C1086_U2J-3316409.pdf; ComponentLink3Description: Datasheet3; ComponentLink3URL: https://product.tdk.com/system/files/dam/doc/product/capacitor/ceramic/mlcc/catalog/mlcc_commercial_soft_en.pdf
C42 C44 C45 C47 C48 C50 C55 C56 = CMP-05427-000869-1: Aluminum Electrolytic Capacitors (Radial Lead Type) 10uF ±20% 100V; Polarity: Polar; Lead Diameter: 0.5mm; Dissipation Factor: 0.1%; Leakage Current: 3uA; Dielectric Material: Aluminium; Ripple Current: 70mA; Life (Hours): 2000Hour; Lead/Base Style: Straight; Length: 11mm; Case/Package: Radial; Lead Pitch: 2mm; Contact Plating: Tin; RoHS Compliant: Yes; Radiation Hardening: No; Max Operating Temperature: 85°C; Lead Free: Lead Free; Termination: Radial; Voltage Rating: 100V; Package Quantity: 200; Voltage: 100V; Construction: RADIAL; Height: 11mm; Min Operating Temperature: -40°C; Diameter: 5mm; REACH SVHC: No SVHC; Tolerance: 20%; Width: 5mm; Height - Seated (Max): 0.472inch; Mount: Through Hole; Series: M; Voltage Rating (DC): 100V; Packaging: Bulk; Ripple Current (AC): 70mA; Number of Pins: 2
C51-C54 = CMP-05427-000661-1: as C31 on sheet RGB to PAL Encoder; REACH SVHC: No SVHC; Tolerance: 20%; Max Operating Temperature: 105°C; RoHS Compliant: Yes; Height - Seated (Max): 0.492inch; Number of Pins: 2; Case/Package: Radial; Series: FM; ESR (Equivalent Series Resistance): 340mR; Length: 11mm; Radiation Hardening: No; Voltage: 50V; Min Operating Temperature: -40°C; Voltage Rating: 50V; Voltage Rating (DC): 50V; Lead Free: Lead Free; Package Quantity: 200; Lead Pitch: 2mm; Height: 11mm; Mount: Through Hole; Construction: RADIAL; Termination: Radial; Diameter: 5mm; Packaging: Bulk
R59 R65-R70 = CMP-2100-03667-1: as R1 on sheet Sync Decoder; Width: 0.8mm; Max Operating Temperature: 155degC; Tolerance: 5%; Package Reference: 0603; Height: 0.45mm; Depth: 0.8mm; Package Description: 2-Pin Surface Mount Device, Body 1.6 x 0.8 mm; Termination: SMD/SMT; Package Quantity: 5000; Case/Package: 0603; Case Code (Imperial): 0603; Radiation Hardening: No; Number of Pins: 2; Length: 1.6mm; Lead Free: LeadFree; Voltage Rating (DC): 50V; Military Standard: Not; Datasheet URL: http://www.yageo.com/NewPortal/yageodocoutput?fileName=/pdf/R-Chip/PYu-RC_Group_51_RoHS_L_5.pdf; Manufacturer URL: http://www.yageo.com/; Packaging: TapeandReel; Case Code (Metric): 1608; Min Operating Temperature: -55degC; Composition: ThickFilm; RoHSCompliant: true; Contact Plating: Tin; Datasheet Version: Rev. 5, 10/2016; REACH SVHC: NoSVHC
R60-R63 R71-R74 = CMP-2100-03667-1: Chip Resistor, 0 Ohm, +/- 5%, 0.1 W, -55 to 155 degC, 0603 (1608 Metric), RoHS, Tape and Reel; Manufacturer: Yageo; Temperature Coefficient: 200ppm/degreesC; Voltage Rating: 50V; Power Rating: 100mW; Resistance: 560 Ohm; Width: 0.8mm; Max Operating Temperature: 155degC; Tolerance: 5%; Package Reference: 0603; Height: 0.45mm; Depth: 0.8mm; Package Description: 2-Pin Surface Mount Device, Body 1.6 x 0.8 mm; Termination: SMD/SMT; Package Quantity: 5000; Case/Package: 0603; Case Code (Imperial): 0603; Radiation Hardening: No; Number of Pins: 2; Length: 1.6mm; Lead Free: LeadFree; Voltage Rating (DC): 50V; Military Standard: Not; Datasheet URL: http://www.yageo.com/NewPortal/yageodocoutput?fileName=/pdf/R-Chip/PYu-RC_Group_51_RoHS_L_5.pdf; Manufacturer URL: http://www.yageo.com/; Packaging: TapeandReel; Case Code (Metric): 1608; Min Operating Temperature: -55degC; Composition: ThickFilm; RoHSCompliant: true; Contact Plating: Tin; Datasheet Version: Rev. 5, 10/2016; REACH SVHC: NoSVHC
R64 = Preset_4K7_Caceres: as R22 on sheet Audio Memory; PartNumber: 3386P-1-472LF; ComponentLink1Description: Package Specification; ComponentLink1URL: https://ar.mouser.com/datasheet/2/54/3386-776606.pdf; ComponentLink2Description: URL Link; ComponentLink2URL: https://www.mouser.com/ProductDetail/Bourns/3386P-1-472LF?qs=g1MxsQ5vwlSvqan31esVSg%3D%3D
U10 U11 = TDA8540_Caceres: as U8 on sheet Video OUT; ComponentLink1Description: Datasheet; ComponentLink1URL: https://pdf1.alldatasheet.es/datasheet-pdf/view/19499/PHILIPS/TDA8540.html; ComponentLink2Description: URL Link; ComponentLink2URL: https://www.nxp.com/products/no-longer-manufactured/tda8540t:TDA8540T; ComponentLink3Description: Discontinuation Notice; ComponentLink3URL: https://www.nxp.com/wcm_documents/products/eol/dn46exha.pdf; ComponentLink4Description: Package Specification; ComponentLink4URL: https://html.alldatasheet.es/html-pdf/19499/PHILIPS/TDA8540/3258/13/TDA8540.html; PartNumber: TDA8540; PackageReference: DIP20; Status: Discontinued